# Altium schematic sheet WS2812_MATRIX_6.SchDoc
size A4
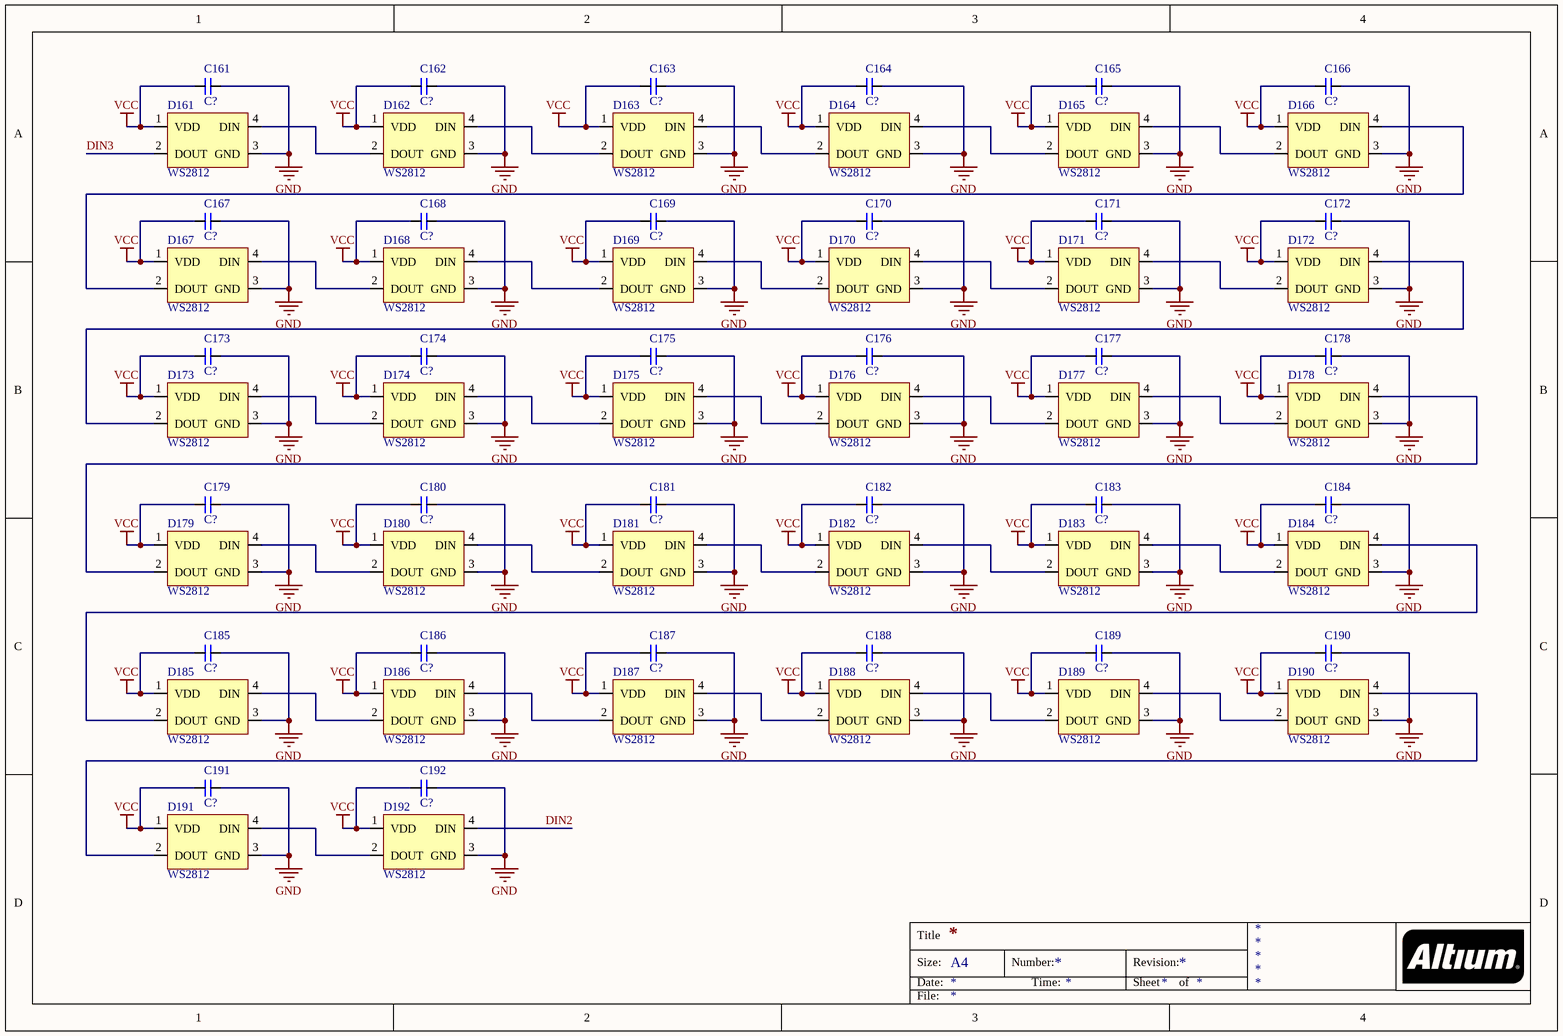
[diagram p0: WS2812_MATRIX_6.SchDoc]

## Parts
C161  C?  [C0603]
C162  C?  [C0603]
C163  C?  [C0603]
C164  C?  [C0603]
C165  C?  [C0603]
C166  C?  [C0603]
C167  C?  [C0603]
C168  C?  [C0603]
C169  C?  [C0603]
C170  C?  [C0603]
C171  C?  [C0603]
C172  C?  [C0603]
C173  C?  [C0603]
C174  C?  [C0603]
C175  C?  [C0603]
C176  C?  [C0603]
C177  C?  [C0603]
C178  C?  [C0603]
C179  C?  [C0603]
C180  C?  [C0603]
C181  C?  [C0603]
C182  C?  [C0603]
C183  C?  [C0603]
C184  C?  [C0603]
C185  C?  [C0603]
C186  C?  [C0603]
C187  C?  [C0603]
C188  C?  [C0603]
C189  C?  [C0603]
C190  C?  [C0603]
C191  C?  [C0603]
C192  C?  [C0603]
D161  WS2812  [WS2812_3528]
D162  WS2812  [WS2812_3528]
D163  WS2812  [WS2812_3528]
D164  WS2812  [WS2812_3528]
D165  WS2812  [WS2812_3528]
D166  WS2812  [WS2812_3528]
D167  WS2812  [WS2812_3528]
D168  WS2812  [WS2812_3528]
D169  WS2812  [WS2812_3528]
D170  WS2812  [WS2812_3528]
D171  WS2812  [WS2812_3528]
D172  WS2812  [WS2812_3528]
D173  WS2812  [WS2812_3528]
D174  WS2812  [WS2812_3528]
D175  WS2812  [WS2812_3528]
D176  WS2812  [WS2812_3528]
D177  WS2812  [WS2812_3528]
D178  WS2812  [WS2812_3528]
D179  WS2812  [WS2812_3528]
D180  WS2812  [WS2812_3528]
D181  WS2812  [WS2812_3528]
D182  WS2812  [WS2812_3528]
D183  WS2812  [WS2812_3528]
D184  WS2812  [WS2812_3528]
D185  WS2812  [WS2812_3528]
D186  WS2812  [WS2812_3528]
D187  WS2812  [WS2812_3528]
D188  WS2812  [WS2812_3528]
D189  WS2812  [WS2812_3528]
D190  WS2812  [WS2812_3528]
D191  WS2812  [WS2812_3528]
D192  WS2812  [WS2812_3528]

## Nets
GND: C161.2 C162.2 C163.2 C164.2 C165.2 C166.2 C167.2 C168.2 C169.2 C170.2 C171.2 C172.2 C173.2 C174.2 C175.2 C176.2 C177.2 C178.2 C179.2 C180.2 C181.2 C182.2 C183.2 C184.2 C185.2 C186.2 C187.2 C188.2 C189.2 C190.2 C191.2 C192.2 D161.3(GND) D162.3(GND) D163.3(GND) D164.3(GND) D165.3(GND) D166.3(GND) D167.3(GND) D168.3(GND) D169.3(GND) D170.3(GND) D171.3(GND) D172.3(GND) D173.3(GND) D174.3(GND) D175.3(GND) D176.3(GND) D177.3(GND) D178.3(GND) D179.3(GND) D180.3(GND) D181.3(GND) D182.3(GND) D183.3(GND) D184.3(GND) D185.3(GND) D186.3(GND) D187.3(GND) D188.3(GND) D189.3(GND) D190.3(GND) D191.3(GND) D192.3(GND)
VCC: C161.1 C162.1 C163.1 C164.1 C165.1 C166.1 C167.1 C168.1 C169.1 C170.1 C171.1 C172.1 C173.1 C174.1 C175.1 C176.1 C177.1 C178.1 C179.1 C180.1 C181.1 C182.1 C183.1 C184.1 C185.1 C186.1 C187.1 C188.1 C189.1 C190.1 C191.1 C192.1 D161.1(VDD) D162.1(VDD) D163.1(VDD) D164.1(VDD) D165.1(VDD) D166.1(VDD) D167.1(VDD) D168.1(VDD) D169.1(VDD) D170.1(VDD) D171.1(VDD) D172.1(VDD) D173.1(VDD) D174.1(VDD) D175.1(VDD) D176.1(VDD) D177.1(VDD) D178.1(VDD) D179.1(VDD) D180.1(VDD) D181.1(VDD) D182.1(VDD) D183.1(VDD) D184.1(VDD) D185.1(VDD) D186.1(VDD) D187.1(VDD) D188.1(VDD) D189.1(VDD) D190.1(VDD) D191.1(VDD) D192.1(VDD)
DIN2: D192.4(DIN)
DIN3: D161.2(DOUT)
NetD161_4: D161.4(DIN) D162.2(DOUT)
NetD162_4: D162.4(DIN) D163.2(DOUT)
NetD163_4: D163.4(DIN) D164.2(DOUT)
NetD164_4: D164.4(DIN) D165.2(DOUT)
NetD165_4: D165.4(DIN) D166.2(DOUT)
NetD166_4: D166.4(DIN) D167.2(DOUT)
NetD167_4: D167.4(DIN) D168.2(DOUT)
NetD168_4: D168.4(DIN) D169.2(DOUT)
NetD169_4: D169.4(DIN) D170.2(DOUT)
NetD170_4: D170.4(DIN) D171.2(DOUT)
NetD171_4: D171.4(DIN) D172.2(DOUT)
NetD172_4: D172.4(DIN) D173.2(DOUT)
NetD173_4: D173.4(DIN) D174.2(DOUT)
NetD174_4: D174.4(DIN) D175.2(DOUT)
NetD175_4: D175.4(DIN) D176.2(DOUT)
NetD176_4: D176.4(DIN) D177.2(DOUT)
NetD177_4: D177.4(DIN) D178.2(DOUT)
NetD178_4: D178.4(DIN) D179.2(DOUT)
NetD179_4: D179.4(DIN) D180.2(DOUT)
NetD180_4: D180.4(DIN) D181.2(DOUT)
NetD181_4: D181.4(DIN) D182.2(DOUT)
NetD182_4: D182.4(DIN) D183.2(DOUT)
NetD183_4: D183.4(DIN) D184.2(DOUT)
NetD184_4: D184.4(DIN) D185.2(DOUT)
NetD185_4: D185.4(DIN) D186.2(DOUT)
NetD186_4: D186.4(DIN) D187.2(DOUT)
NetD187_4: D187.4(DIN) D188.2(DOUT)
NetD188_4: D188.4(DIN) D189.2(DOUT)
NetD189_4: D189.4(DIN) D190.2(DOUT)
NetD190_4: D190.4(DIN) D191.2(DOUT)
NetD191_4: D191.4(DIN) D192.2(DOUT)

## Notes on the sheet
- Title
- Size:
- Date:
- A4
- Number:
- Time:
- Revision:
- Sheet
- of
- File:

## Library data of the parts
C161-C192 = CAP